# EAGLE schematic Voltmeter (EAGLE 9.6.2)
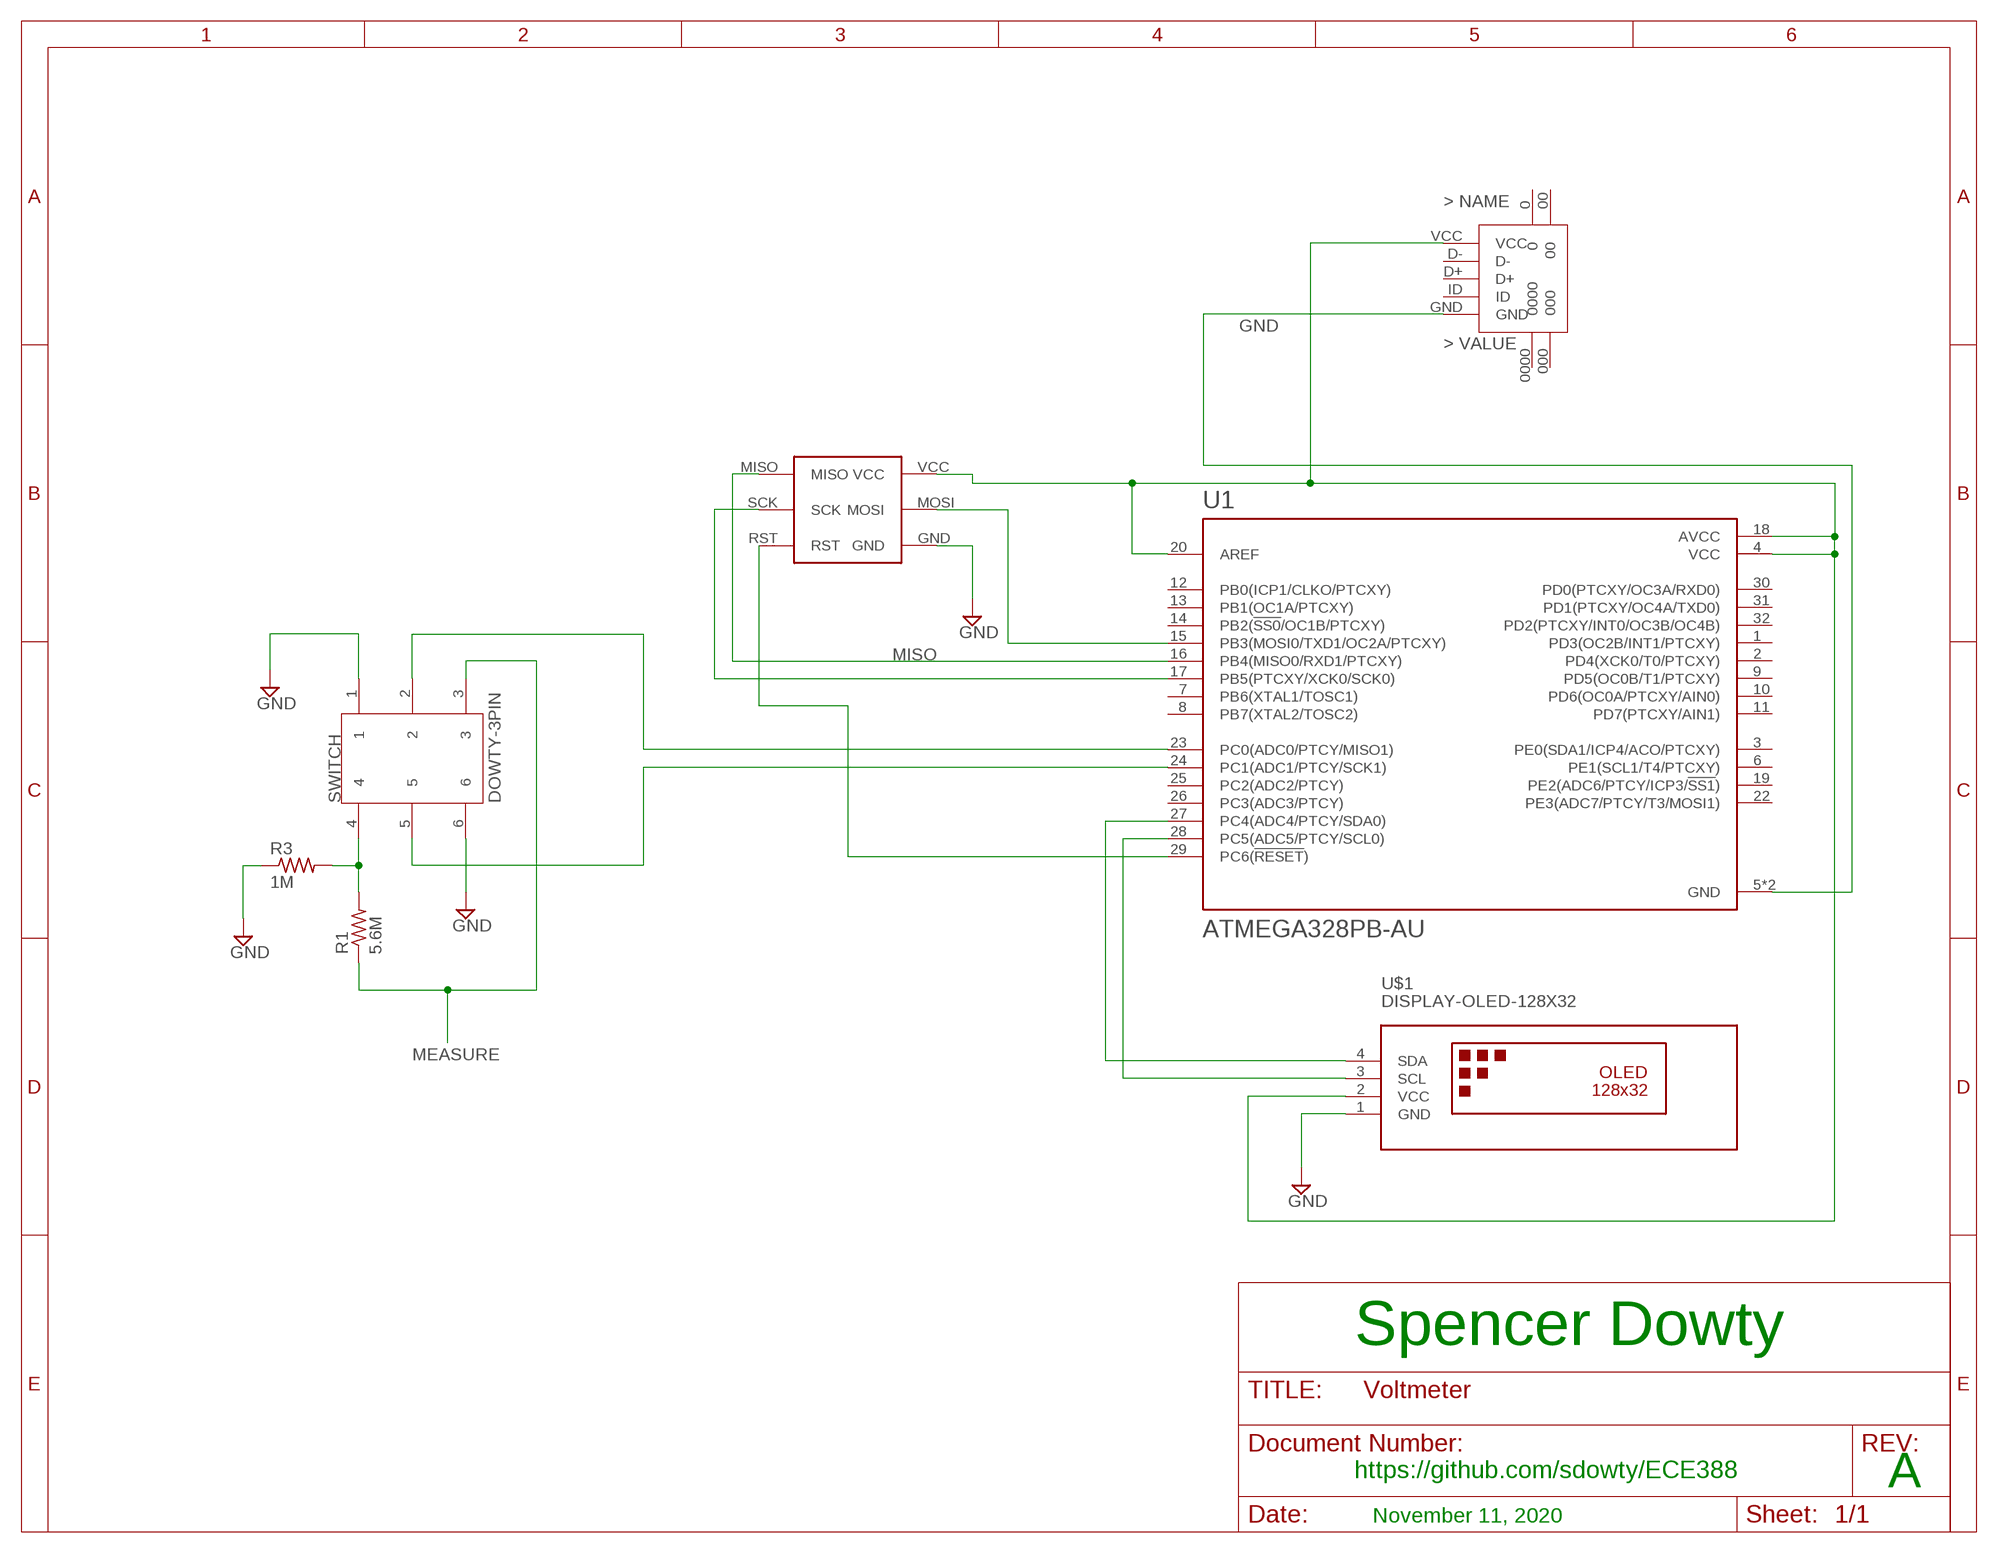
[diagram p0: schematic, sheet 1]

## Parts
6-PIN_ADAPTER  AVR-ISP  [AVR-ISP]
MICRO-USB1  MICRO-USB-DOWTY  [MICRO-USB-DOWTY]
R1  5.6M  R-US_R0805  [R0805]
R3  1M  R-US_R0805  [R0805]
SWITCH  DOWTY-3PIN  [DOWTY-3PIN]
U1  ATMEGA328PB-AU  [QFP80P900X900X120-32N]
U$1  DISPLAY-OLED-128X32  [DISPLAY-OLED-128X32]

## Nets
GND: 6-PIN_ADAPTER.GND MICRO-USB1.GND R3.1 SWITCH.1 SWITCH.6 U1.5(GND) U1.21(GND) U$1.1(GND)
MEASURE: R1.1 SWITCH.3
MISO: 6-PIN_ADAPTER.MISO U1.16(PB4(MISO0/RXD1/PTCXY))
N$1: R1.2 R3.2 SWITCH.4
N$4: SWITCH.2 U1.23(PC0(ADC0/PTCY/MISO1))
N$6: SWITCH.5 U1.24(PC1(ADC1/PTCY/SCK1))
N$9: U1.27(PC4(ADC4/PTCY/SDA0)) U$1.4(SDA)
N$11: 6-PIN_ADAPTER.SCK U1.17(PB5(PTCXY/XCK0/SCK0))
N$13: 6-PIN_ADAPTER.MOSI U1.15(PB3(MOSI0/TXD1/OC2A/PTCXY))
RESET: 6-PIN_ADAPTER.RST U1.29(PC6(!RESET!))
SCL: U1.28(PC5(ADC5/PTCY/SCL0)) U$1.3(SCL)
VIN: 6-PIN_ADAPTER.VCC MICRO-USB1.VCC U1.4(VCC) U1.18(AVCC) U1.20(AREF) U$1.2(VCC)
Unconnected: MICRO-USB1.0000 MICRO-USB1.00 MICRO-USB1.0 MICRO-USB1.000 MICRO-USB1.D+ MICRO-USB1.D- MICRO-USB1.ID U1.1(PD3(OC2B/INT1/PTCXY)) U1.2(PD4(XCK0/T0/PTCXY)) U1.3(PE0(SDA1/ICP4/ACO/PTCXY)) U1.6(PE1(SCL1/T4/PTCXY)) U1.7(PB6(XTAL1/TOSC1)) U1.8(PB7(XTAL2/TOSC2)) U1.9(PD5(OC0B/T1/PTCXY)) U1.10(PD6(OC0A/PTCXY/AIN0)) U1.11(PD7(PTCXY/AIN1)) U1.12(PB0(ICP1/CLKO/PTCXY)) U1.13(PB1(OC1A/PTCXY)) U1.14(PB2(!SS0!/OC1B/PTCXY)) U1.19(PE2(ADC6/PTCY/ICP3/!SS1!)) U1.22(PE3(ADC7/PTCY/T3/MOSI1)) U1.25(PC2(ADC2/PTCY)) U1.26(PC3(ADC3/PTCY)) U1.30(PD0(PTCXY/OC3A/RXD0)) U1.31(PD1(PTCXY/OC4A/TXD0)) U1.32(PD2(PTCXY/INT0/OC3B/OC4B))

## Notes on the sheet
- Spencer Dowty
- https://github.com/sdowty/ECE388
- A
- November 11, 2020

## Library data of the parts
6-PIN_ADAPTER = AVR-ISP:AVR-ISP: Check prices <https://pricing.snapeda.com/search/part/AVR-ISP/?ref=eda>; AVAILABILITY: Bad; DESCRIPTION: Emulators / Simulators AVR USB IN CIRCUIT EMUL/PRGMR ISP; MF: Gravitech; MP: AVR-ISP; PACKAGE: None; PRICE: None
MICRO-USB1 = USB-MICRO:MICRO-USB-DOWTY
R1 R3 = rcl:R-US_: RESISTOR, American symbol; SPICEPREFIX: R
SWITCH = 3pin:DOWTY-3PIN
U1 = ATMEGA328PB-AU (1):ATMEGA328PB-AU: ATmega Series 20 MHz 32 KB Flash 2 KB SRAM 8-Bit Microcontroller - TQFP-32 Check prices <https://pricing.snapeda.com/search/part/ATMEGA328PB-AU/?ref=eda>; AVAILABILITY: Good; DESCRIPTION: 8-bit Microcontrollers - MCU ATMEGA328PB 20MHZ IND TEMP; MF: Microchip Technology / Atmel; MP: ATMEGA328PB-AU; PACKAGE: None; PRICE: None; PURCHASE-URL: https://pricing.snapeda.com/search/part/ATMEGA328PB-AU/?ref=eda
U$1 = diy-modules:DISPLAY-OLED-128X32: 128x32 Dot Matrix OLED Module with I2C interface based on SSD1306 chip More details available here: http://www.tinyosshop.com/index.php?route=product/product&product_id=953 Schematic available here: http://www.tinyosshop.com/datasheet/OLED%2012832.pdf SSD1306 datasheet: https://cdn-shop.adafruit.com/datasheets/SSD1306.pdf Click here to find device on ebay.com <http://www.ebay.com/sch/oled+display+128x32+i2c>